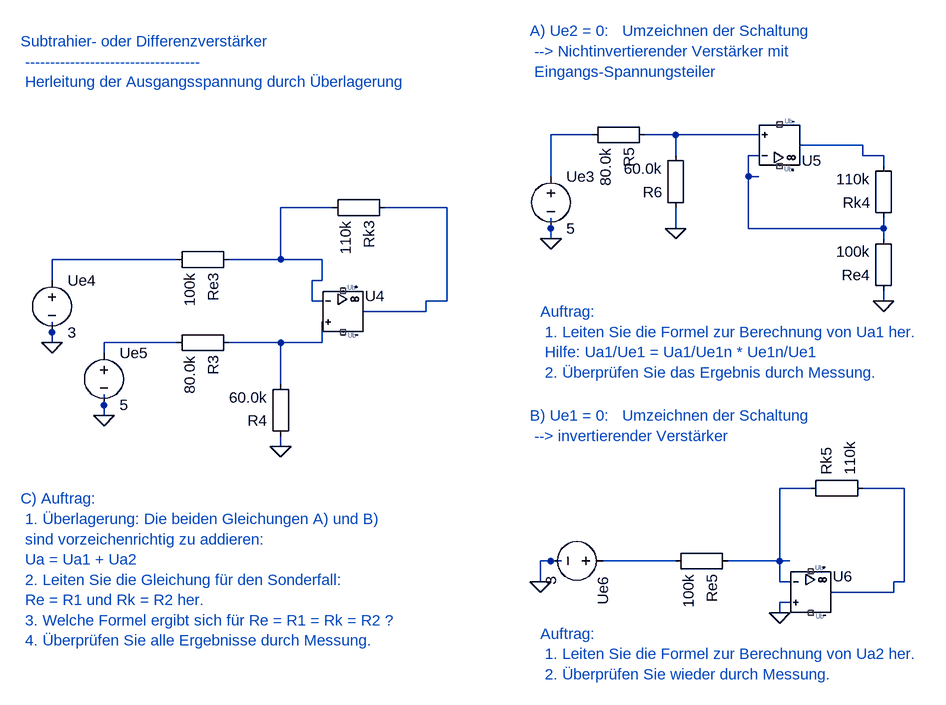
[diagram p0: schematic 1_3_1_Exkurs_Subtrahierverstärker.asc]
1_3_1_Exkurs_Subtrahierverstärker.asc, the LTspice schematic file:
Version 4
SHEET 1 880 680
WIRE 544 448 528 448
WIRE 528 448 528 416
WIRE 528 416 544 416
WIRE 608 464 704 464
WIRE 704 464 704 448
WIRE 1216 224 1200 224
WIRE 1200 224 1200 256
WIRE 1200 256 1216 256
WIRE 1280 208 1376 208
WIRE 1376 208 1376 224
WIRE 896 336 896 320
WIRE 128 496 128 480
WIRE 208 608 208 592
WIRE 1264 880 1248 880
WIRE 1248 880 1248 848
WIRE 1248 848 1264 848
WIRE 1328 896 1424 896
WIRE 1424 896 1424 880
WIRE 896 848 912 848
WIRE 1088 336 1088 304
WIRE 1088 224 1088 192
WIRE 1088 192 1040 192
WIRE 1216 192 1088 192
WIRE 1408 448 1408 432
WIRE 1408 240 1408 224
WIRE 1408 224 1376 224
WIRE 1408 352 1408 336
WIRE 1200 256 1200 336
WIRE 1200 336 1408 336
WIRE 896 256 896 192
WIRE 896 192 960 192
WIRE 896 352 896 320
WIRE 128 416 128 384
WIRE 128 384 320 384
WIRE 128 480 128 512
WIRE 208 528 208 512
WIRE 208 512 320 512
WIRE 208 592 208 624
WIRE 400 384 480 384
WIRE 400 512 480 512
WIRE 480 512 544 512
WIRE 544 512 544 480
WIRE 480 576 480 512
WIRE 480 656 480 672
WIRE 480 384 544 384
WIRE 544 384 544 416
WIRE 560 304 480 304
WIRE 480 304 480 384
WIRE 640 304 736 304
WIRE 736 304 736 448
WIRE 736 448 704 448
WIRE 1408 336 1408 320
WIRE 1248 928 1248 912
WIRE 1248 912 1264 912
WIRE 880 880 880 848
WIRE 880 848 912 848
WIRE 976 848 1088 848
WIRE 1168 848 1248 848
WIRE 1296 736 1248 736
WIRE 1248 736 1248 848
WIRE 1376 736 1440 736
WIRE 1440 736 1440 880
WIRE 1440 880 1424 880
FLAG 480 672 0
FLAG 1088 336 0
FLAG 1408 448 0
FLAG 896 352 0
FLAG 128 512 0
FLAG 208 624 0
FLAG 1248 928 0
FLAG 880 880 0
FLAG 480 672 0
FLAG 1088 336 0
FLAG 1408 448 0
FLAG 896 352 0
FLAG 128 512 0
FLAG 208 624 0
FLAG 1248 928 0
FLAG 880 880 0
SYMBOL UniversalOpAmp2 576 464 R0
SYMATTR InstName U4
SYMATTR Value UniversalOpAmp2
SYMBOL Misc\EuropeanResistor 416 496 R90
SYMATTR InstName R3
SYMATTR Value 80.0k
SYMBOL Misc\EuropeanResistor 496 672 R180
SYMATTR InstName R4
SYMATTR Value 60.0k
SYMBOL Misc\EuropeanResistor 656 288 R90
SYMATTR InstName Rk3
SYMATTR Value 110k
SYMBOL Misc\EuropeanResistor 416 368 R90
SYMATTR InstName Re3
SYMATTR Value 100k
SYMBOL UniversalOpAmp2 1248 208 M180
SYMATTR InstName U5
SYMATTR Value UniversalOpAmp2
SYMBOL Misc\EuropeanResistor 1056 176 R90
SYMATTR InstName R5
SYMATTR Value 80.0k
SYMBOL Misc\EuropeanResistor 1104 320 R180
SYMATTR InstName R6
SYMATTR Value 60.0k
SYMBOL Misc\EuropeanResistor 1424 336 R180
SYMATTR InstName Rk4
SYMATTR Value 110k
SYMBOL Misc\EuropeanResistor 1424 448 R180
SYMATTR InstName Re4
SYMATTR Value 100k
SYMBOL voltage 896 240 R0
SYMATTR InstName Ue3
SYMATTR Value 5
SYMBOL voltage 128 400 R0
SYMATTR InstName Ue4
SYMATTR Value 3
SYMBOL voltage 208 512 R0
SYMATTR InstName Ue5
SYMATTR Value 5
SYMBOL UniversalOpAmp2 1296 896 R0
SYMATTR InstName U6
SYMATTR Value UniversalOpAmp2
SYMBOL Misc\EuropeanResistor 1184 832 R90
SYMATTR InstName Re5
SYMATTR Value 100k
SYMBOL Misc\EuropeanResistor 1280 752 R270
SYMATTR InstName Rk5
SYMATTR Value 110k
SYMBOL voltage 992 848 R90
SYMATTR InstName Ue6
SYMATTR Value 3
TEXT 80 48 Left 2 ;Subtrahier- oder Differenzverstärker \n ----------------------------------- \n Herleitung der Ausgangsspannung durch Überlagerung
TEXT 864 32 Left 2 ;A) Ue2 = 0:   Umzeichnen der Schaltung \n --> Nichtinvertierender Verstärker mit \n Eingangs-Spannungsteiler
TEXT 880 464 Left 2 ;Auftrag: \n 1. Leiten Sie die Formel zur Berechnung von Ua1 her. \n Hilfe: Ua1/Ue1 = Ua1/Ue1n * Ue1n/Ue1 \n 2. Überprüfen Sie das Ergebnis durch Messung.
TEXT 864 624 Left 2 ;B) Ue1 = 0:   Umzeichnen der Schaltung \n --> invertierender Verstärker
TEXT 880 960 Left 2 ;Auftrag: \n 1. Leiten Sie die Formel zur Berechnung von Ua2 her. \n 2. Überprüfen Sie wieder durch Messung.
TEXT 80 752 Left 2 ;C) Auftrag: \n 1. Überlagerung: Die beiden Gleichungen A) und B) \n sind vorzeichenrichtig zu addieren: \n Ua = Ua1 + Ua2 \n 2. Leiten Sie die Gleichung für den Sonderfall: \n Re = R1 und Rk = R2 her. \n 3. Welche Formel ergibt sich für Re = R1 = Rk = R2 ? \n 4. Überprüfen Sie alle Ergebnisse durch Messung.

The netlist it stands for:
* 1_3_1_Exkurs_Subtrahierverstärker.asc
XU4 N011 N001 NC_01 NC_02 N002 level2 UniversalOpAmp2 Avol=1Meg GBW=10Meg Slew=10Meg Ilimit=25m Rail=0 Vos=0 En=0 Enk=0 In=0 Ink=0 Rin=500Meg  ; pins In+ In- V+ V- OUT
R3 N011 N010 80.0k
R4 0 N011 60.0k
Rk3 N002 N001 110k
Re3 N001 N009 100k
XU5 N007 N003 NC_03 NC_04 N004 level2 UniversalOpAmp2 Avol=1Meg GBW=10Meg Slew=10Meg Ilimit=25m Rail=0 Vos=0 En=0 Enk=0 In=0 Ink=0 Rin=500Meg  ; pins In+ In- V+ V- OUT
R5 N007 N008 80.0k
R6 0 N007 60.0k
Rk4 N003 N004 110k
Re4 0 N003 100k
V§Ue3 N008 0 5
V§Ue4 N009 0 3
V§Ue5 N010 0 5
XU6 0 N005 NC_05 NC_06 N006 level2 UniversalOpAmp2 Avol=1Meg GBW=10Meg Slew=10Meg Ilimit=25m Rail=0 Vos=0 En=0 Enk=0 In=0 Ink=0 Rin=500Meg  ; pins In+ In- V+ V- OUT
Re5 N005 N012 100k
Rk5 N005 N006 110k
V§Ue6 N012 0 3
* Subtrahier- oder Differenzverstärker
*  -----------------------------------
*  Herleitung der Ausgangsspannung durch Überlagerung
* A) Ue2 = 0:   Umzeichnen der Schaltung
*  --> Nichtinvertierender Verstärker mit
*  Eingangs-Spannungsteiler
* Auftrag:
*  1. Leiten Sie die Formel zur Berechnung von Ua1 her.
*  Hilfe: Ua1/Ue1 = Ua1/Ue1n * Ue1n/Ue1
*  2. Überprüfen Sie das Ergebnis durch Messung.
* B) Ue1 = 0:   Umzeichnen der Schaltung
*  --> invertierender Verstärker
* Auftrag:
*  1. Leiten Sie die Formel zur Berechnung von Ua2 her.
*  2. Überprüfen Sie wieder durch Messung.
* C) Auftrag:
*  1. Überlagerung: Die beiden Gleichungen A) und B)
*  sind vorzeichenrichtig zu addieren:
*  Ua = Ua1 + Ua2
*  2. Leiten Sie die Gleichung für den Sonderfall:
*  Re = R1 und Rk = R2 her.
*  3. Welche Formel ergibt sich für Re = R1 = Rk = R2 ?
*  4. Überprüfen Sie alle Ergebnisse durch Messung.
.lib UniversalOpAmp2.lib
.backanno
.end